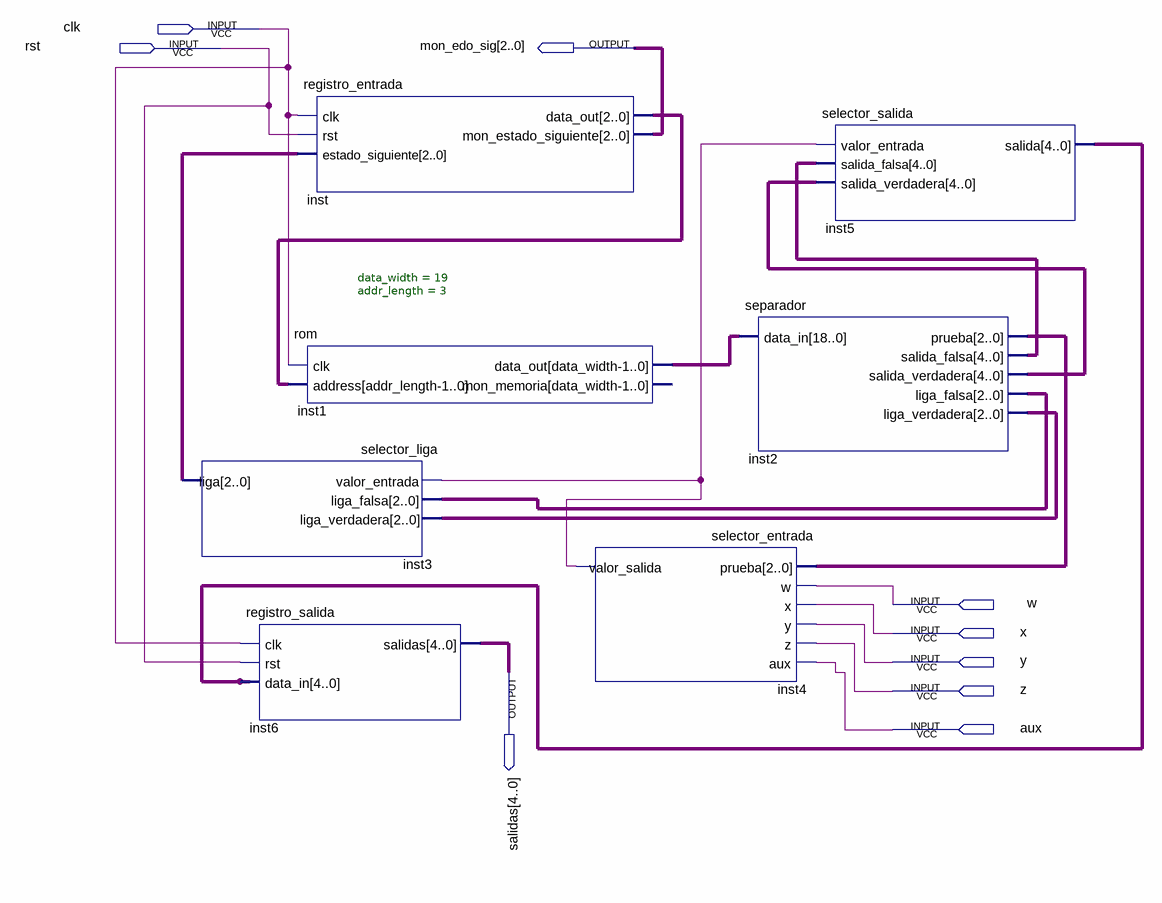
[diagram p0: schematic sheet]
// Quartus schematic practica_4.bdf as structural Verilog: 7 symbols, 9 pins
module practica_4 (
  input  clk,
  input  rst,
  input  w,
  input  x,
  input  y,
  input  z,
  input  aux,
  output [2:0] mon_edo_sig,
  output [4:0] salidas
);

  wire inst4_valor_salida;
  wire [2:0] inst2_liga_falsa, inst2_liga_verdadera, inst2_prueba, inst3_liga, inst_data_out;
  wire [4:0] inst2_salida_falsa, inst2_salida_verdadera, inst5_salida;
  wire [18:0] inst1_data_out;

  selector_liga inst3 (
    .valor_entrada(inst4_valor_salida), .liga_falsa(inst2_liga_falsa), .liga_verdadera(inst2_liga_verdadera),
    .liga(inst3_liga));
  registro_salida inst6 (.clk(clk), .rst(rst), .data_in(inst5_salida), .salidas(salidas));
  registro_entrada inst (
    .clk(clk), .rst(rst), .estado_siguiente(inst3_liga), .data_out(inst_data_out),
    .mon_estado_siguiente(mon_edo_sig));
  rom #(.data_width(19), .addr_length(3)) inst1 (
    .clk(clk), .address(inst_data_out), .data_out(inst1_data_out));  // open: mon_memoria
  selector_entrada inst4 (
    .prueba(inst2_prueba), .w(w), .x(x), .y(y), .z(z), .aux(aux), .valor_salida(inst4_valor_salida));
  separador inst2 (
    .data_in(inst1_data_out), .prueba(inst2_prueba), .salida_falsa(inst2_salida_falsa),
    .salida_verdadera(inst2_salida_verdadera), .liga_falsa(inst2_liga_falsa),
    .liga_verdadera(inst2_liga_verdadera));
  selector_salida inst5 (
    .valor_entrada(inst4_valor_salida), .salida_falsa(inst2_salida_falsa),
    .salida_verdadera(inst2_salida_verdadera), .salida(inst5_salida));
endmodule
